# EasyEDA Pro project ME4Driver.eprj

# Schematic Schematic1
Board Name: Board1; Create Date: 2025-03-02; Page Name: P1; Project Name: ME4Driver; Schematic Name: Schematic1; Update Date: 2025-03-06; Company: 嘉立创EDA; Page Size: A4; Version: V1.0
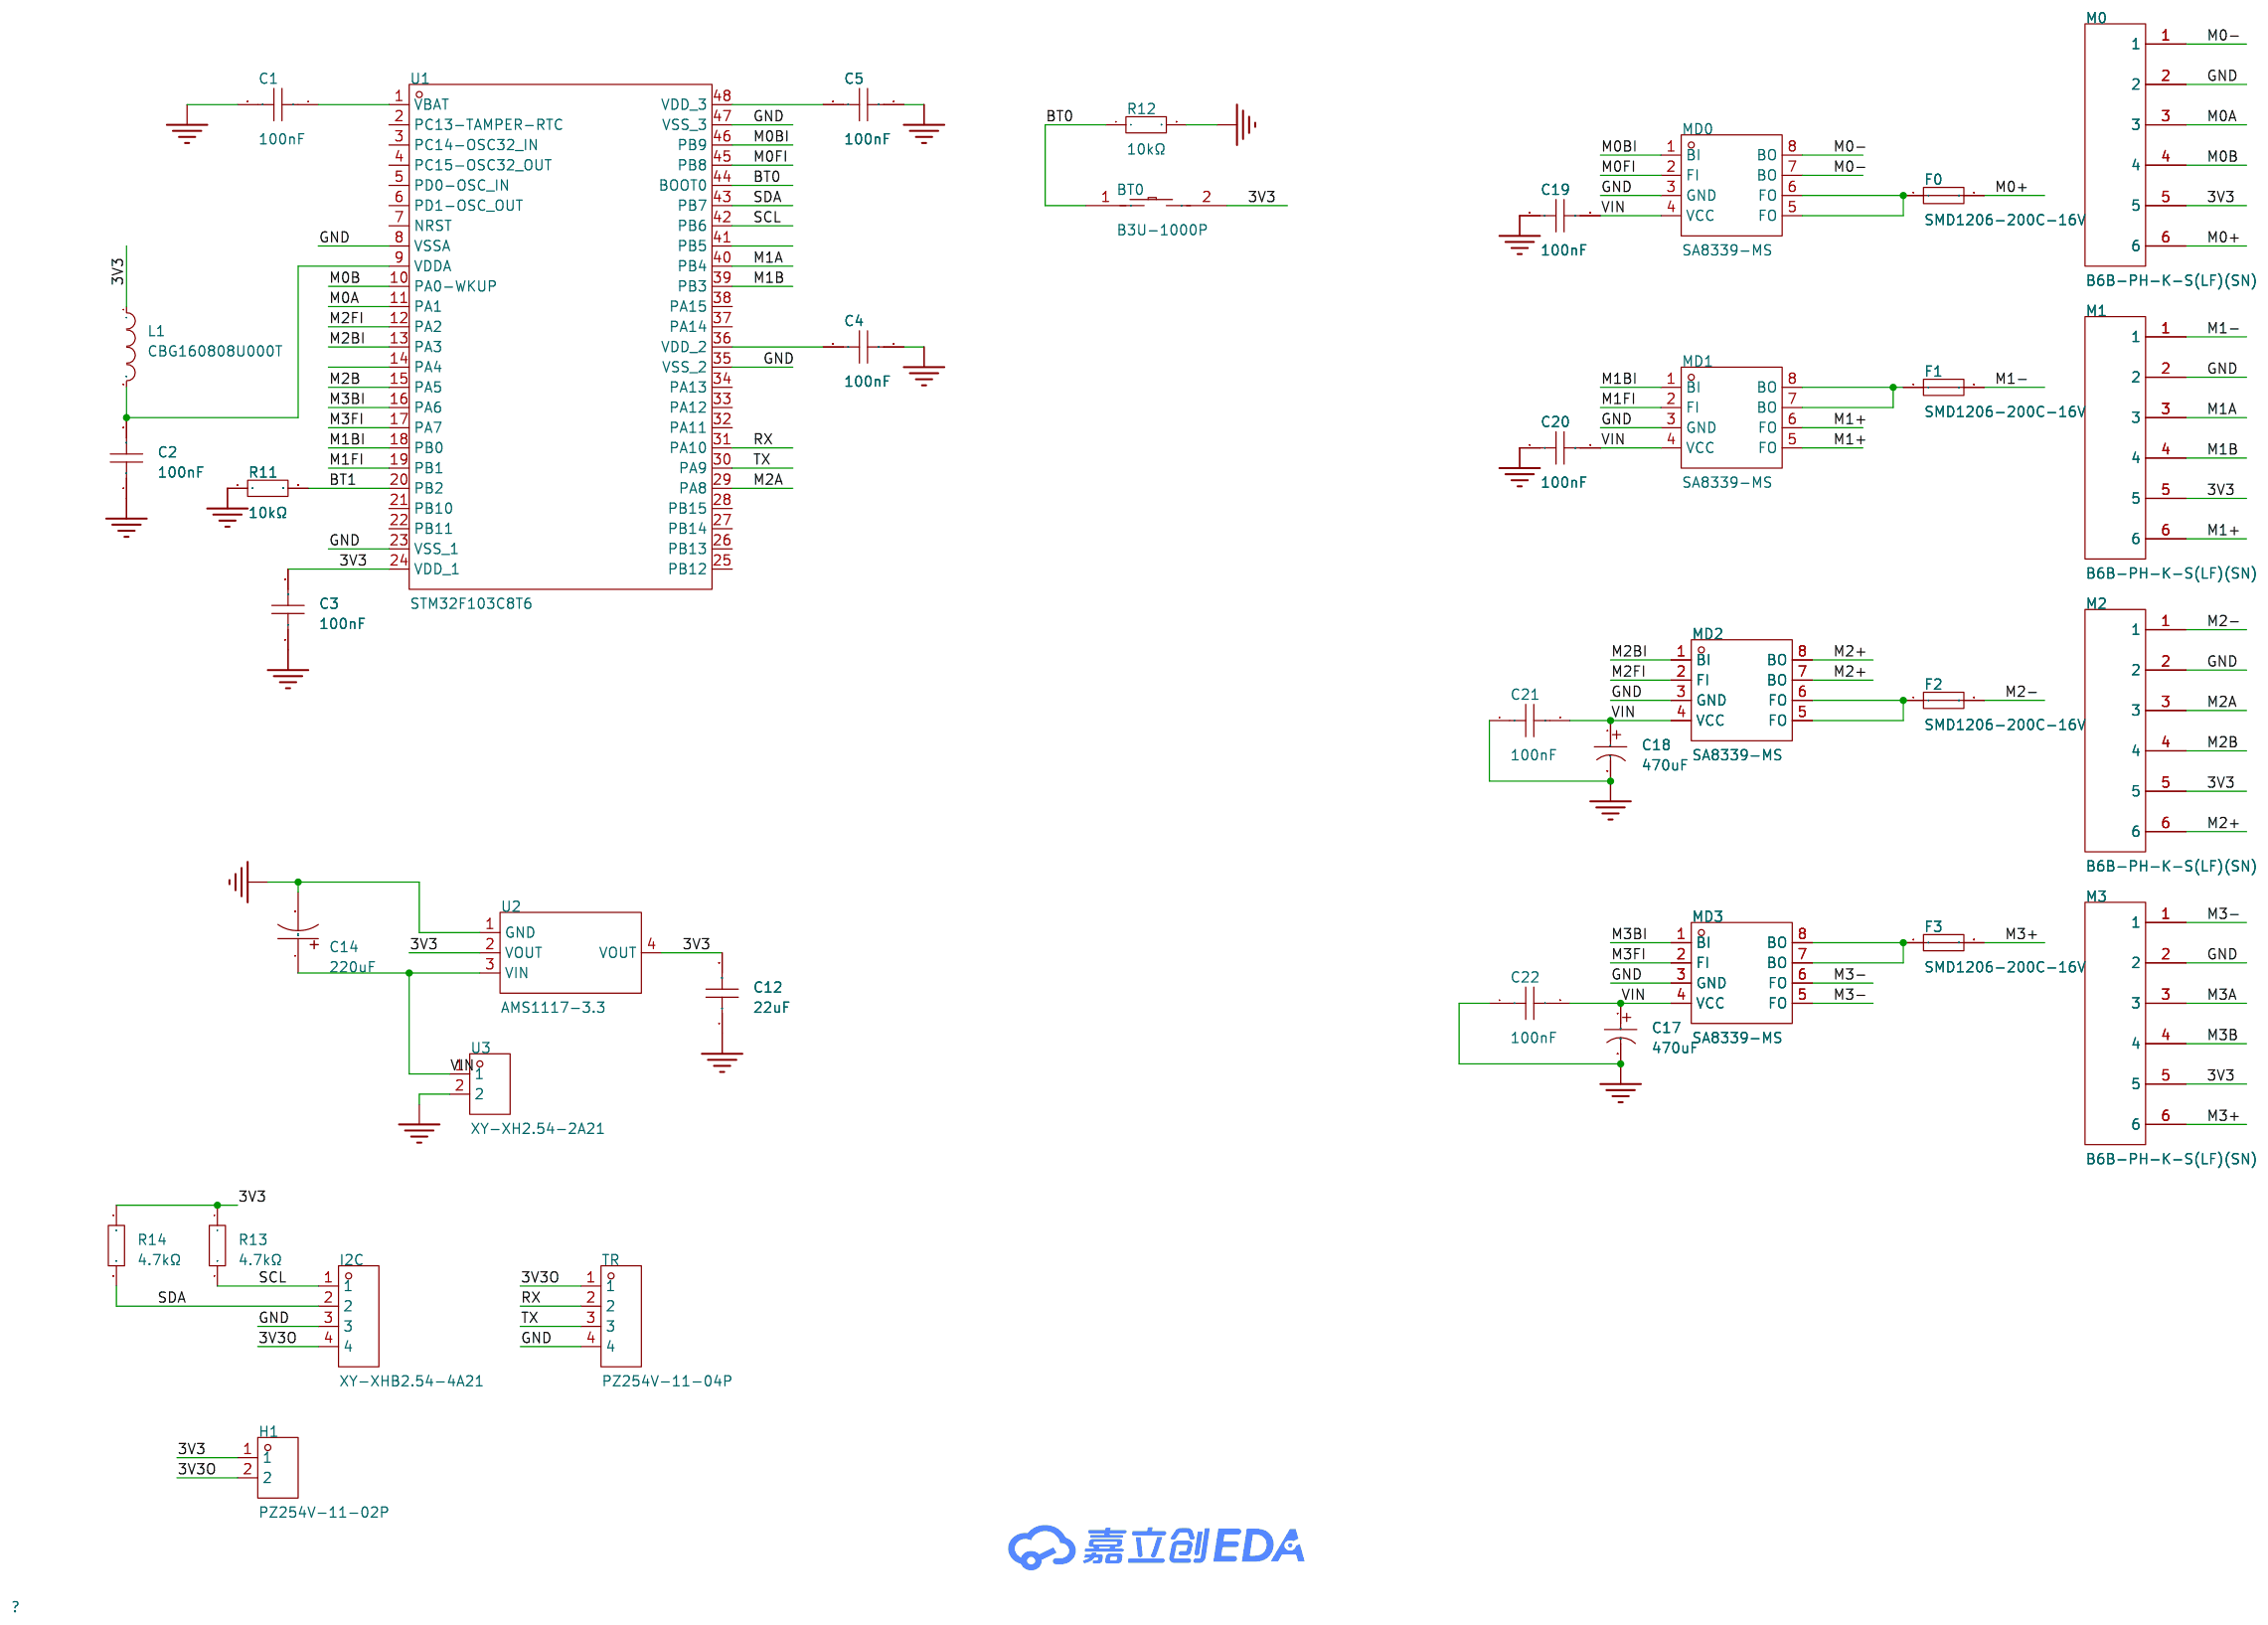
[diagram p0: schematic sheet]

## Parts
BT0  B3U-1000P  [KEY-SMD_B3U-1000PM]
C1  100nF  [C0603]
C2  100nF  [C0603]
C3  100nF  [C0603]
C4  100nF  [C0603]
C5  100nF  [C0603]
C12  22uF  [CASE-A_3216]
C14  220uF  [CAP-SMD_BD6.3-L6.6-W6.6-FD]
C17  470uF  [CAP-TH_BD8.0-P3.50-D0.6-FD]
C18  470uF  [CAP-TH_BD8.0-P3.50-D0.6-FD]
C19  100nF  [C0603]
C20  100nF  [C0603]
C21  100nF  [C0603]
C22  100nF  [C0603]
F0  SMD1206-200C-16V  [F1206]
F1  SMD1206-200C-16V  [F1206]
F2  SMD1206-200C-16V  [F1206]
F3  SMD1206-200C-16V  [F1206]
H1  PZ254V-11-02P  [HDR-TH_2P-P2.54-V-M]
I2C  XY-XHB2.54-4A21  [HDR-TH_4P-P2.50-H-F-W7.3-N]
L1  CBG160808U000T  [L0603]
M0  B6B-PH-K-S(LF)(SN)  [CONN-TH_B6B-PH-K-S]
M1  B6B-PH-K-S(LF)(SN)  [CONN-TH_B6B-PH-K-S]
M2  B6B-PH-K-S(LF)(SN)  [CONN-TH_B6B-PH-K-S]
M3  B6B-PH-K-S(LF)(SN)  [CONN-TH_B6B-PH-K-S]
MD0  SA8339-MS  [SOP-8_L4.9-W3.9-P1.27-LS6.0-BL]
MD1  SA8339-MS  [SOP-8_L4.9-W3.9-P1.27-LS6.0-BL]
MD2  SA8339-MS  [SOP-8_L4.9-W3.9-P1.27-LS6.0-BL]
MD3  SA8339-MS  [SOP-8_L4.9-W3.9-P1.27-LS6.0-BL]
R11  10kΩ  [R0603]
R12  10kΩ  [R0603]
R13  4.7kΩ  [R1206]
R14  4.7kΩ  [R1206]
TR  PZ254V-11-04P  [HDR-TH_4P-P2.54-V-M]
U1  STM32F103C8T6  [LQFP-48_L7.0-W7.0-P0.50-LS9.0-BL]
U2  AMS1117-3.3  [SOT-223-3_L6.5-W3.4-P2.30-LS7.0-BR]
U3  XY-XH2.54-2A21  [HDR-TH_2P-P2.50_XY-XH2.54-2A21]

## Library data of the parts
BT0 = B3U-1000P: LCSC Part Name: 3*2.5*1.6mm 立贴 轻触开关; Supplier Part: C231329; Manufacturer: OMRON(欧姆龙); Supplier Footprint: SMD,2.5x3mm; JLCPCB Part Class: 扩展库; Supplier: LCSC; Circuit: 单刀单掷; Actuator Style: 圆形按钮; Operating Force: 1.53N; Mounting Style: 立贴; Switch Length: 3mm; Switch Width: 2.5mm; Switch Height: 1.6mm; Contact Current: 50mA; Voltage Rating (DC): 12V; Pin Style: SMD接片; Operating Temperature: -25℃~+70℃
C1-C5 C19-C22 = CGA0603X7R104K500JT: 容值:100nF;精度:±10%;额定电压:50V;材质(温度系数):X7R;; LCSC Part Name: 100nF ±10% 50V; Supplier Part: C6119867; Manufacturer: HRE(芯声); Supplier Footprint: 0603; JLCPCB Part Class: 扩展库; Supplier: LCSC; Tolerance: ±10%; Voltage Rated: 50V; Temperature Coefficient: X7R
C12 = TAJA226K010RNJ: LCSC Part Name: 22uF ±10% 10V; Supplier Part: C11366; Manufacturer: Kyocera AVX; Supplier Footprint: CASE-A-3216; JLCPCB Part Class: Extended Part; Datasheet: https://atta.szlcsc.com/upload/public/pdf/source/20160107/1457707750344.pdf; Supplier: LCSC; Tolerance: ±10%; Rated Voltage: 10V; Equivalent Series Resistance(ESR): 3Ω@100kHz; Operating Temperature: -55℃~+125℃
C14 = VT1C221M-CRE77: LCSC Part Name: 220uF ±20% 16V; Supplier Part: C294521; Manufacturer: VT(首科); Supplier Footprint: SMD,D6.3xL7.7mm; JLCPCB Part Class: 扩展库; Datasheet: https://atta.szlcsc.com/upload/public/pdf/source/20181029/C324063_620585B2DB5C8ABB183828EAB4CD59C7.pdf; Supplier: LCSC; Tolerance: ±20%; Rated Voltage: 16V; φD: 6.3mm; L: 7.7mm; Lifetime @ Temp: 1000hrs@105℃; Operating Temperature: -40℃~+105℃
C17 C18 = KF471M025F115A: LCSC Part Name: 470uF ±20% 25V; Supplier Part: C59352; Manufacturer: CapXon(丰宾); Supplier Footprint: 插件,D8xL11.5mm; JLCPCB Part Class: Extended Part; Datasheet: https://atta.szlcsc.com/upload/public/pdf/source/20160702/1467448308274.pdf; Supplier: LCSC; Tolerance: ±20%; Rated Voltage: 25V; Lead Spacing: 3.5mm; φD: 8mm; L: 11.5mm; Lifetime @ Temp: 3000hrs@105℃
F0-F3 = SMD1206-200C-16V: LCSC Part Name: 16V 2A 1206自恢复; Supplier Part: C2843986; Manufacturer: BNstar(比诺星); Supplier Footprint: 1206; JLCPCB Part Class: Extended Part; Datasheet: https://atta.szlcsc.com/upload/public/pdf/source/20210702/C2843986_521BE662BDE0C432A0859FD7515D21C0.pdf; Supplier: LCSC; Voltage - Max: 16V; Current - Max: 40A; Hold Current: 2A; Trip Current: 3.5A; Power Dissipation: 800mW; Resistance - Initial (Ri) (Min): 15mΩ; Resistance - Post Trip (R1) (Max): 80mΩ; Time to Trip(Max): 1.5s; Operating Temperature: -40℃~+85℃
H1 = PZ254V-11-02P: LCSC Part Name: 间距:2.54mm 1x2P 直插 方针; Supplier Part: C492401; Manufacturer: XFCN(兴飞); Supplier Footprint: 插件,P=2.54mm; JLCPCB Part Class: 扩展库; Datasheet: https://atta.szlcsc.com/upload/public/pdf/source/20200309/C492401_A812433581A9B211A7FFA413ADDFF0E5.pdf; Supplier: LCSC; Pin Structure: 1x2P; Pitch: 2.54mm; Circluar Pins/Square Pins: 方针; Mounting Type: 直插; Number of Rows: 单排; Number of Pins: 2P; Length of Mating Pin: 6mm; Insulation Height: 2.5mm; Length of End Connection Pin: 3mm; Contact Material: 黄铜; Operating Temperature Range: -40℃~+105℃; Color: 黑色
I2C = XY-XHB2.54-4A21: LCSC Part Name: 1x4P 间距:2.54mm 弯插; Supplier Part: C19271397; Manufacturer: XYECONN(辛译); Supplier Footprint: 弯插,P=2.54mm; JLCPCB Part Class: 扩展库; Datasheet: https://atta.szlcsc.com/upload/public/pdf/source/20231124/E581531705911B495C6E735B7C4EA3F8.pdf; Supplier: LCSC; Pins Structure: 1x4P; Pitch: 2.54mm; Mounting Style: 弯插; Number of Pins: 4P; Number of Rows: 1; Number of PINs Per Row: 4; Row Spacing: 2.54mm; Current Rating (Max): 2A; Operating Temperature Range: -25℃~+85℃
L1 = CBG160808U000T: 标称阻抗@测试频率:0Ω@100MHz;直流电阻(RDC):100mΩ;; LCSC Part Name: 单路 0603磁珠 阻抗0Ω@100MHz; Supplier Part: C43163; Manufacturer: FH(风华); Supplier Footprint: 0603; JLCPCB Part Class: 扩展库; Datasheet: https://atta.szlcsc.com/upload/public/pdf/source/20190129/C361667_1614D407CC98D1D3CFBD9E1F7511C14D.pdf; Supplier: LCSC; Impedance @ Frequency: 0Ω@100MHz; DC Resistance: 100mΩ; Current Rating: 800mA; Circuits: 1
M0-M3 = B6B-PH-K-S(LF)(SN): LCSC Part Name: 1x6P 间距:2mm 直插 系列:PH; Supplier Part: C131342; Manufacturer: JST; Supplier Footprint: 插件,P=2mm; JLCPCB Part Class: 扩展库; Datasheet: https://atta.szlcsc.com/upload/public/pdf/source/20171026/C131342_15089839687311058815.pdf; Supplier: LCSC; Pins Structure: 1x6P; Pitch: 2mm; Mounting Style: 直插; Reference Series: PH; Number of Pins: 6P; Number of Rows: 1; Number of PINs Per Row: 6; Current Rating (Max): 2A; Contact Material: 黄铜; Contact Plating: 锡; Operating Temperature Range: -25℃~+85℃; Rated Voltage (Max): 100V; Plastic Material: PA66; Flame Retardant Rating: UL94V-0; Supplementary Features: 打K脚; Colour: 白色; Z-Height of the Board: 6mm; X-Length of Bottom Edge on Board (Spacing Line): 13.9mm; Y-Width of Bottom Edge on Board: 4.5mm
MD0-MD3 = SA8339-MS: Supplier Part: C22462547; Manufacturer: MSKSEMI(美森科); Supplier Footprint: SOP-8; JLCPCB Part Class: 扩展库; Datasheet: https://atta.szlcsc.com/upload/public/pdf/source/20240621/3CEF47547D05350EDF4225945F34EFF8.pdf; Supplier: LCSC
R11 R12 = 0603WAF1002T5E: 电阻类型:厚膜电阻;阻值:10kΩ;精度:±1%;功率:100mW;最大工作电压:75V;温度系数:±100ppm/℃;; LCSC Part Name: 厚膜电阻 10kΩ ±1% 100mW; Supplier Part: C25804; Manufacturer: UNI-ROYAL(厚声); Supplier Footprint: 0603; JLCPCB Part Class: Basic Part; Datasheet: https://atta.szlcsc.com/upload/public/pdf/source/20200306/C422600_1E6D84923E4A46A82E41ADD87F860B5C.pdf; Supplier: LCSC; Type: 厚膜电阻; Tolerance: ±1%; Power(Watts): 100mW; Overload Voltage (Max): 75V; Temperature Coefficient: ±100ppm/℃; Operating Temperature Range: -55℃~+155℃
R13 R14 = 1206W4F4701T5E: LCSC Part Name: 4.7kΩ ±1% 250mW 厚膜电阻; Supplier Part: C17936; Manufacturer: UNI-ROYAL(厚声); Supplier Footprint: 1206; JLCPCB Part Class: 基础库; Datasheet: https://atta.szlcsc.com/upload/public/pdf/source/20200306/C422600_1E6D84923E4A46A82E41ADD87F860B5C.pdf; Supplier: LCSC; Type: 厚膜电阻; Tolerance: ±1%; Power(Watts): 250mW; Overload Voltage (Max): 200V; Temperature Coefficient: ±100ppm/℃; Operating Temperature Range: -55℃~+155℃
TR = PZ254V-11-04P: LCSC Part Name: 间距:2.54mm 1x4P 直插 方针; Supplier Part: C2691448; Manufacturer: XFCN(兴飞); Supplier Footprint: 插件,P=2.54mm; JLCPCB Part Class: 扩展库; Datasheet: https://atta.szlcsc.com/upload/public/pdf/source/20200309/C492403_F9F19131791D08044AD4F84F8E751A34.pdf; Supplier: LCSC; Pin Structure: 1x4P; Pitch: 2.54mm; Circluar Pins/Square Pins: 方针; Mounting Type: 直插; Number of Rows: 单排; Number of Pins: 4P; Current Rating (Max): 3A; Voltage Rating (Max): 250V; Length of Mating Pin: 6mm; Insulation Height: 2.5mm; Length of End Connection Pin: 3mm; Operating Temperature Range: -40℃~+105℃; Color: 黑色
U1 = STM32F103C8T6: LCSC Part Name: 主流增强型ARM Cortex-M3 MCU，具有64 KB Flash、72 MHz CPU、电机控制、USB和CAN; Supplier Part: C8734; Manufacturer: ST(意法半导体); Supplier Footprint: LQFP-48(7x7); JLCPCB Part Class: 扩展库; Datasheet: https://atta.szlcsc.com/upload/public/pdf/source/20220812/8363ACEC51AD55ECEB84799464F7CB85.pdf; Supplier: LCSC; CPU Core: ARM-M3; CPU Maximum Speed: 72MHz; Program Storage Size: 64KB; Program Memory Type: FLASH; Number of I/O: 37; ADC (Bit): 12bit; Low Voltage Detection Threshold: 2V~3.6V
U2 = AMS1117-3.3_C6186: LCSC Part Name: 输出3.3V 1A; Supplier Part: C6186; Manufacturer: AMS; Supplier Footprint: SOT-223; JLCPCB Part Class: Basic Part; Datasheet: https://atta.szlcsc.com/upload/public/pdf/source/20180727/C6186_7A095716F0823C02F1997A905E26C086.pdf; Supplier: LCSC; Output Type: 固定; Output Voltage: 3.3V; Output Current: 1A; Power Supply Rejection Ratio (PSRR): 72dB@(120Hz); Voltage Dropout: 1.3V@(800mA); Features: 过流保护(OCP)；热保护(TSD); Output Configuration: 正极; Number of Outputs: 1
U3 = XY-XH2.54-2A21: LCSC Part Name: 1x2P 间距:2.54mm 弯插; Supplier Part: C19271377; Manufacturer: XYECONN(辛译); Supplier Footprint: 弯插,P=2.54mm; JLCPCB Part Class: 扩展库; Datasheet: https://atta.szlcsc.com/upload/public/pdf/source/20231124/D66390E8C06C0EE50596E66A88591188.pdf; Supplier: LCSC; Pins Structure: 1x2P; Pitch: 2.54mm; Mounting Style: 弯插; Number of Pins: 2P; Number of Rows: 1; Number of PINs Per Row: 2; Row Spacing: 2.54mm; Current Rating (Max): 3A; Operating Temperature Range: -25℃~+85℃

## Nets
3V3: BT0.2 C3.2 C12.2 H1.1 L1.1 M0.5 M1.5 M2.5 M3.5 R13.1 R14.1 U1.24(VDD_1) U2.2(VOUT) U2.4(VOUT)
3V3O: H1.2 I2C.4 TR.1
GND: C1.2 C2.1 C3.1 C4.1 C5.1 C12.1 C14.2 C17.2 C18.2 C19.1 C20.1 C21.1 C22.1 I2C.3 M0.2 M1.2 M2.2 M3.2 MD0.3(GND) MD1.3(GND) MD2.3(GND) MD3.3(GND) R11.1 R12.2 TR.4 U1.8(VSSA) U1.23(VSS_1) U1.35(VSS_2) U1.47(VSS_3) U2.1(GND) U3.2
VIN: C14.1 C17.1 C18.1 C19.2 C20.2 C21.2 C22.2 MD0.4(VCC) MD1.4(VCC) MD2.4(VCC) MD3.4(VCC) U2.3(VIN) U3.1
BT0: BT0.1 R12.1 U1.44(BOOT0)
BT1: R11.2 U1.20(PB2)
M0+: F0.2 M0.6
M0-: M0.1 MD0.7(BO) MD0.8(BO)
M0A: M0.3 U1.11(PA1)
M0B: M0.4 U1.10(PA0-WKUP)
M0BI: MD0.1(BI) U1.46(PB9)
M0FI: MD0.2(FI) U1.45(PB8)
M1+: M1.6 MD1.5(FO) MD1.6(FO)
M1-: F1.2 M1.1
M1A: M1.3 U1.40(PB4)
M1B: M1.4 U1.39(PB3)
M1BI: MD1.1(BI) U1.18(PB0)
M1FI: MD1.2(FI) U1.19(PB1)
M2+: M2.6 MD2.7(BO) MD2.8(BO)
M2-: F2.2 M2.1
M2A: M2.3 U1.29(PA8)
M2B: M2.4 U1.15(PA5)
M2BI: MD2.1(BI) U1.13(PA3)
M2FI: MD2.2(FI) U1.12(PA2)
M3+: F3.2 M3.6
M3-: M3.1 MD3.5(FO) MD3.6(FO)
M3A: M3.3
M3B: M3.4
M3BI: MD3.1(BI) U1.16(PA6)
M3FI: MD3.2(FI) U1.17(PA7)
RX: TR.2 U1.31(PA10)
SCL: I2C.1 R13.2 U1.42(PB6)
SDA: I2C.2 R14.2 U1.43(PB7)
TX: TR.3 U1.30(PA9)
$1N1753: C5.2 U1.48(VDD_3)
$1N1757: C4.2 U1.36(VDD_2)
$1N2374: F0.1 MD0.5(FO) MD0.6(FO)
$1N2423: F2.1 MD2.5(FO) MD2.6(FO)
$1N2448: F3.1 MD3.7(BO) MD3.8(BO)
$1N5496: C2.2 L1.2 U1.9(VDDA)
$1N5615: C1.1 U1.1(VBAT)
$1N7076: F1.1 MD1.7(BO) MD1.8(BO)

Not connected (* = marked no-connect by the designer): U1 2(PC13-TAMPER-RTC) 3(PC14-OSC32_IN) 4(PC15-OSC32_OUT) 5(PD0-OSC_IN) 6(PD1-OSC_OUT) 7(NRST) 14(PA4) 21(PB10) 22(PB11) 25(PB12) 26(PB13) 27(PB14) 28(PB15) 32(PA11) 33(PA12) 34(PA13) 37(PA14) 38(PA15) 41(PB5)

# Board PCB1
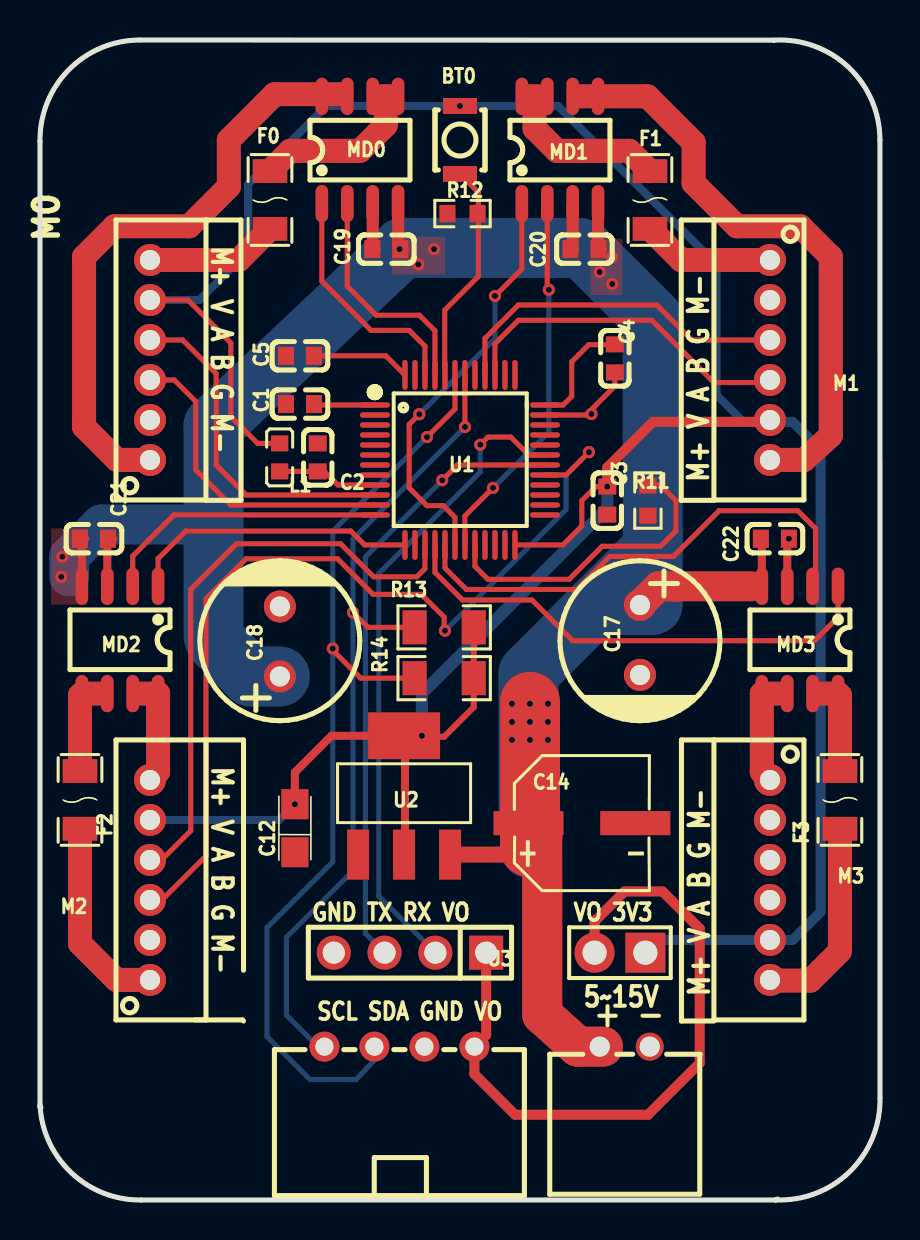
[diagram p1: board, top side]
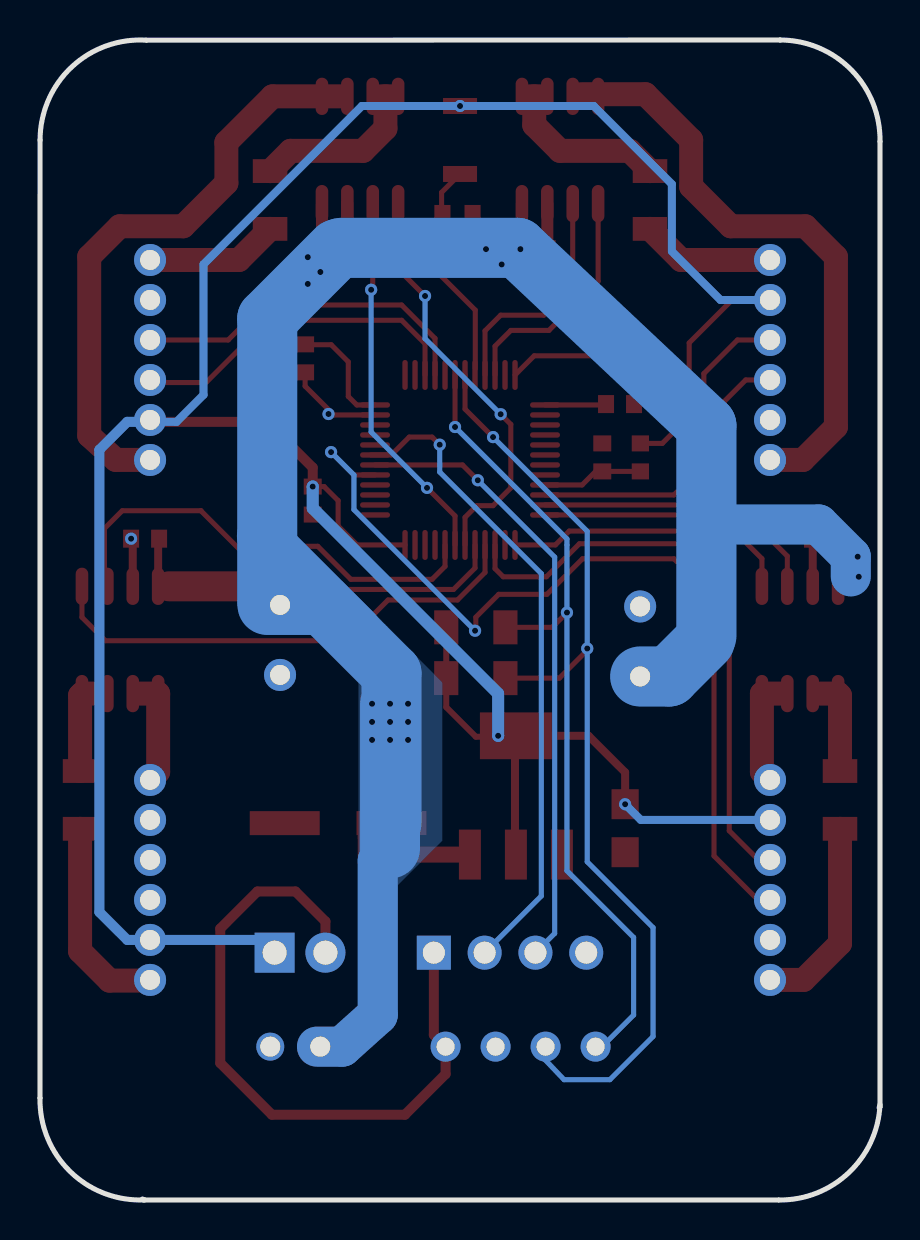
[diagram p2: board, bottom side, seen from below]

Outline 42 x 58.01 mm; copper layers: Top Layer, Bottom Layer. Coordinates in mm from the lower left corner of the outline.
Outline path: 0.04,4.62 0,4.67 0,52.93 arc(1.44,56.51) 5,58.01 36.7,58 arc(40.43,56.64) 42,53 42,5.1 arc(40.5,1.43) 36.79,0.01 36.88,0.05 ; 0,4.78 arc(1.56,1.37) 5.06,0 36.83,0
Stack: Top Layer 0.035mm / Dielectric1 1.51mm FR4 er 4.5 / Bottom Layer 0.035mm

## Design rules (mm)
template: JLCPCB Capability(Two Layers Board)
spacing copperThickness1oz (default): track to track 0.102, other pairs 0.152 to 0.3
spacing copperThickness2oz: track to track 0.203, other pairs 0.152 to 0.3
track width copperThickness1oz (default): min 0.127, default 0.254, max 2.54
track width copperThickness2oz: min 0.203, default 0.254, max 2.54
differential pair differentialPair (default): width min 0.127, default 0.254, max 2.54; gap min 0.152, default 0.152
via viaSize (default): diameter min 0.5, default 0.61, max 10; hole min 0.3, default 0.305, max 6.3

## Placement (name value [footprint] x y rotation side)
BT0  B3U-1000P  [KEY-SMD_B3U-1000PM]  21 53.01 90 top
C1  100nF  [C0603]  13 39.8 180 top
C2  100nF  [C0603]  13.89 37.13 270 top
C3  100nF  [C0603]  28.37 34.97 90 top
C4  100nF  [C0603]  28.75 42.09 90 top
C5  100nF  [C0603]  13 42.21 0 top
C12  22uF  [CASE-A_3216]  12.75 18.59 90 top
C14  220uF  [CAP-SMD_BD6.3-L6.6-W6.6-FD]  27.1 18.85 0 top
C17  470uF  [CAP-TH_BD8.0-P3.50-D0.6-FD]  30 28.01 270 top
C18  470uF  [CAP-TH_BD8.0-P3.50-D0.6-FD]  11.99 27.93 90 top
C19  100nF  [C0603]  17.32 47.55 0 top
C20  100nF  [C0603]  27.22 47.55 0 top
C21  100nF  [C0603]  2.7 33.07 180 top
C22  100nF  [C0603]  36.75 33.07 180 top
F0  SMD1206-200C-16V  [F1206]  11.5 50.01 270 top
F1  SMD1206-200C-16V  [F1206]  30.5 50.01 270 top
F2  SMD1206-200C-16V  [F1206]  2 20.01 270 top
F3  SMD1206-200C-16V  [F1206]  40 20.01 270 top
H1  PZ254V-11-02P  [HDR-TH_2P-P2.54-V-M]  29 12.37 180 top
I2C  XY-XHB2.54-4A21  [HDR-TH_4P-P2.50-H-F-W7.3-N]  17.97 7.67 0 top
L1  CBG160808U000T  [L0603]  11.98 37.13 270 top
M0  B6B-PH-K-S(LF)(SN)  [CONN-TH_B6B-PH-K-S]  5.5 42.01 270 top
M1  B6B-PH-K-S(LF)(SN)  [CONN-TH_B6B-PH-K-S]  36.5 42.01 90 top
M2  B6B-PH-K-S(LF)(SN)  [CONN-TH_B6B-PH-K-S]  5.5 16.01 270 top
M3  B6B-PH-K-S(LF)(SN)  [CONN-TH_B6B-PH-K-S]  36.5 16.01 90 top
MD0  SA8339-MS  [SOP-8_L4.9-W3.9-P1.27-LS6.0-BL]  16 52.51 0 top
MD1  SA8339-MS  [SOP-8_L4.9-W3.9-P1.27-LS6.0-BL]  26 52.51 0 top
MD2  SA8339-MS  [SOP-8_L4.9-W3.9-P1.27-LS6.0-BL]  4 28.01 180 top
MD3  SA8339-MS  [SOP-8_L4.9-W3.9-P1.27-LS6.0-BL]  38 28.01 180 top
R11  10kΩ  [R0603]  30.4 34.97 90 top
R12  10kΩ  [R0603]  21.13 49.33 180 top
R13  4.7kΩ  [R1206]  20.21 28.64 180 top
R14  4.7kΩ  [R1206]  20.21 26.1 180 top
TR  PZ254V-11-04P  [HDR-TH_4P-P2.54-V-M]  18.5 12.37 180 top
U1  STM32F103C8T6  [LQFP-48_L7.0-W7.0-P0.50-LS9.0-BL]  21 37.01 270 top
U2  AMS1117-3.3  [SOT-223-3_L6.5-W3.4-P2.30-LS7.0-BR]  18.21 20.24 270 top
U3  XY-XH2.54-2A21  [HDR-TH_2P-P2.50_XY-XH2.54-2A21]  29.24 7.67 0 top

## Footprints (pads in the part's own frame, mm; a bottom-side part is the same pattern mirrored in y, then rotated)
C0603
  rect 0.8x0.9 smd: 1(-0.7,0) 2(0.7,0)
CAP-SMD_BD6.3-L6.6-W6.6-FD
  rect 3.5x1.2 smd: 1(-2.67,0) 2(2.67,0)
CAP-TH_BD8.0-P3.50-D0.6-FD
  round 1.6 hole 1: 1(-1.75,0) 2(1.75,0)
CASE-A_3216
  rect 1.5x1.359 smd: 1(-1.2,0) 2(1.2,0)
CONN-TH_B6B-PH-K-S
  round 1.6 hole 1: 1(5,0) 2(3,0) 3(1,0) 4(-1,0) 5(-3,0) 6(-5,0)
F1206
  rect 1.19x1.728 smd: 1(-1.445,0) 2(1.445,0)
HDR-TH_2P-P2.50_XY-XH2.54-2A21
  rect 1.4x1.4 hole 1: 1(-1.25,0)
  round 1.4 hole 1: 2(1.25,0)
HDR-TH_2P-P2.54-V-M
  rect 2x2 hole 1.2: 1(-1.27,0)
  round 2 hole 1.2: 2(1.27,0)
HDR-TH_4P-P2.50-H-F-W7.3-N
  round 1.5 hole 0.9: 1(-3.75,0) 2(-1.25,0) 3(1.25,0) 4(3.75,0)
HDR-TH_4P-P2.54-V-M
  rect 1.7x1.7 hole 1.1: 1(-3.81,0)
  round 1.7 hole 1.1: 2(-1.27,0) 3(1.27,0) 4(3.81,0)
KEY-SMD_B3U-1000PM
  rect 0.8x1.7 smd: 1(-1.7,0) 2(1.7,0)
L0603
  rect 0.8x0.864 smd: 1(-0.7,0) 2(0.7,0)
LQFP-48_L7.0-W7.0-P0.50-LS9.0-BL
  oval 0.27x1.5 smd: 1(-2.75,-4.25) 2(-2.25,-4.25) 3(-1.75,-4.25) 4(-1.25,-4.25) 5(-0.75,-4.25) 6(-0.25,-4.25) 7(0.25,-4.25) 8(0.75,-4.25) 9(1.25,-4.25) 10(1.75,-4.25) 11(2.25,-4.25) 12(2.75,-4.25) 25(2.75,4.25) 26(2.25,4.25) 27(1.75,4.25) 28(1.25,4.25) 29(0.75,4.25) 30(0.25,4.25) 31(-0.25,4.25) 32(-0.75,4.25) 33(-1.25,4.25) 34(-1.75,4.25) 35(-2.25,4.25) 36(-2.75,4.25)
  oval 1.5x0.27 smd: 13(4.25,-2.75) 14(4.25,-2.25) 15(4.25,-1.75) 16(4.25,-1.25) 17(4.25,-0.75) 18(4.25,-0.25) 19(4.25,0.25) 20(4.25,0.75) 21(4.25,1.25) 22(4.25,1.75) 23(4.25,2.25) 24(4.25,2.75) 37(-4.25,2.75) 38(-4.25,2.25) 39(-4.25,1.75) 40(-4.25,1.25) 41(-4.25,0.75) 42(-4.25,0.25) 43(-4.25,-0.25) 44(-4.25,-0.75) 45(-4.25,-1.25) 46(-4.25,-1.75) 47(-4.25,-2.25) 48(-4.25,-2.75)
R0603
  rect 0.806x0.864 smd: 1(-0.753,0) 2(0.753,0)
R1206
  rect 1.208x1.701 smd: 1(-1.479,0) 2(1.479,0)
SOP-8_L4.9-W3.9-P1.27-LS6.0-BL
  oval 0.63x1.865 smd: 1(-1.905,-2.683) 2(-0.635,-2.683) 3(0.635,-2.683) 4(1.905,-2.683) 5(1.905,2.683) 6(0.635,2.683) 7(-0.635,2.683) 8(-1.905,2.683)
SOT-223-3_L6.5-W3.4-P2.30-LS7.0-BR
  rect 2.5x1.1 smd: 1(2.97,-2.3) 2(2.97,0) 3(2.97,2.3)
  rect 2.34x3.6 smd: 4(-2.97,0)

## Nets
As in the schematic.

Pads without a net: U1 2 3 4 5 6 7 21 22 25 26 27 28 32 33 34 37 38

## Via types
v1: diameter 0.61, hole 0.305, Top Layer to Bottom Layer, 35 vias

## Routing (per net, layer and track width the routed paths; a pad name or vN(x,y) marks a point on that pad's centre or on a via; arc(x,y) is an arc through that point)
3V3: length 157.3
  Top Layer w0.254: M0.5 7.4,45.01 9.54,42.86 9.54,39.18 10.89,37.83 L1.1 ; U1.24 26.15,32.76 27.1,33.7 27.1,34.97 27.8,35.67 v1(28.37,35.67)
  Top Layer w0.3: U2.4 18.25,23.17 20.21,23.17 21.69,24.64 R13.1
  Top Layer w0.4: v1(12.75,19.79) 12.75,21.39 14.57,23.21 U2.4 ; 18.25,23.17 18.25,17.32 U2.2
  Top Layer w0.5: v1(28.37,35.67) 28.37,36.63 30.65,38.91 36.41,38.91 M1.5
  Bottom Layer w0.4: M0.5 7.97,45.01 10.41,47.44 10.41,50.8 14.32,54.71 v1(21,54.71) 25.91,54.71 33.83,46.79 33.83,40.26 35.18,38.91 36.41,38.91 M1.5 ; M2.5 11.96,19.01 v1(12.75,19.79)
  Bottom Layer w0.5: H1.1 30.91,13.01 M3.5 37.64,13.01 39.03,14.4 39.03,37.51 37.64,38.91 36.41,38.91
  Bottom Layer w0.6: v1(19.09,23.21) 19.1,25.32 28.37,34.59 v1(28.37,35.67)
GND: length 14.3
  Top Layer w0.254: U1.35 27.31,39.26 28.75,40.7 28.75,41.39 C4.1
  Top Layer w0.4: 3.67,33.07 3.37,32.77 MD2.3 ; v1(37.45,33.07) 37.37,32.99 MD3.3
  Top Layer w0.6: MD0.3 16.64,47.66 16.74,47.55 ; MD1.3 26.64,47.56 26.65,47.55
  vias: v1(27.58,39.3)
VIN: length 145
  Top Layer w0.4: 2.27,33.07 2.1,33.14 2.1,30.96 ; C22.2 36.1,33.02 MD3.4
  Top Layer w0.6: MD0.4 17.91,47.79 18.14,47.55 ; MD1.4 27.91,47.69 28.05,47.55
  Top Layer w0.8: U2.3 24.77,17.27
  Top Layer w1.5: C17.1 30.93,30.69 31.83,30.69 ; 31.83,30.69 31.8,30.66 ; 31.83,30.69 35.56,30.69
  Top Layer w2: 24.43,18.85 25.12,18.16 25.12,9.27 26.9,7.67 28.15,7.67
  Top Layer w3: 24.5,17.64 24.5,24.91
  Bottom Layer w2: 1.46,31.18 1.46,32.17 3.07,33.78 7.75,33.78 ; 24.5,17.58 25.12,16.97 25.12,9.27 26.9,7.67 28.15,7.67
  Bottom Layer w2.5: 26.19,28.48 30.91,33.2
  Bottom Layer w3: 8.68,28.2 8.68,38.72 18.12,47.61 26.97,47.61 ; 8.76,27.97 10.55,26.18 C18.1 ; 24.43,18.85 24.43,26.34 27.85,29.76 30.63,29.76 ; 24.5,17.58 24.5,24.77 ; 27.16,47.55 30.64,44.07 30.64,29.96
  vias: v1(1.06,31.16) v1(1.12,32.17) v1(17.98,47.55) v1(18.92,46.78) v1(19.7,47.55) v1(23.6,24.81) v1(23.6,23.91) v1(23.6,23.01) v1(24.5,24.81) v1(24.5,23.91) v1(24.5,23.01) v1(25.4,24.81) v1(25.4,23.91) v1(25.4,23.01) v1(27.98,46.4) v1(28.61,47.15) v1(28.61,45.81)
M1BI: length 20.8
  Top Layer w0.254: v1(18.97,39.29) 18.46,38.78 18.46,35.61 19.35,34.72 20.17,34.72 20.75,34.14 U1.18 ; MD1.1 24.1,46.55 v1(22.75,45.2)
  Bottom Layer w0.254: v1(18.97,39.29) 22.75,43.07 v1(22.75,45.2)
M1FI: length 18.8
  Top Layer w0.254: v1(22.65,35.61) 21.25,34.21 U1.19 ; MD1.2 25.37,45.6 v1(25.44,45.52)
  Bottom Layer w0.254: v1(22.65,35.61) 25.45,38.4 v1(25.44,45.52)
M2A: length 45.7
  Top Layer w0.254: M2.3 6.1,15.01 8.3,17.21 8.3,30.06 10.3,32.06 14.88,32.06 16.65,30.29 19.07,30.29 20.21,29.14 20.21,28.5 ; U1.29 26.31,36.26 v1(27.45,37.4)
  Bottom Layer w0.254: v1(20.25,28.47) 26.31,34.52 26.31,36.26 v1(27.45,37.4)
RX: length 32.6
  Top Layer w0.254: v1(22.02,37.77) 22.4,38.15 23.54,38.15 24.43,37.26 25.46,37.26
  Bottom Layer w0.254: TR.2 16.94,15.2 16.94,31.32 22.02,36.4 v1(22.02,37.77)
SCL: length 41.6
  Top Layer w0.254: 15.65,29.36 16.4,28.64 R13.2 ; U1.42 v1(21.25,38.65)
  Bottom Layer w0.254: I2C.1 13.9,7.67 12.32,9.25 12.32,13.13 15.65,16.46 15.65,33.06 v1(21.25,38.65)
  vias: v1(15.65,29.37)
SDA: length 49
  Top Layer w0.254: 14.64,27.49 16.03,26.1 R14.2 ; U1.43 20.75,39.55 v1(19.35,38.15)
  Bottom Layer w0.254: 16.73,7.67 16.73,7 15.8,6.02 13.51,6.02 11.35,8.18 11.35,13.62 14.64,16.91 14.64,33.44 v1(19.35,38.15)
  vias: v1(14.64,27.58)
TX: length 31.1
  Top Layer w0.254: v1(20.11,35.99) 20.88,36.76 U1.30
  Bottom Layer w0.254: v1(20.11,35.99) 16.27,32.15 16.27,13.33 TR.3
3V3O: length 34.4
  Top Layer w0.5: TR.1 22.31,8.26 I2C.4 21.72,6.3 23.75,4.27 30.41,4.27 32.99,6.85 32.99,13.57 31.13,15.43 29.23,15.43 27.73,13.93 H1.2
BT0: length 10.8
  Top Layer w0.254: 20.24,41.58 20.24,44.5 21.92,46.18 21.92,50.38 BT0.1
BT1: length 15.6
  Top Layer w0.254: U1.20 21.75,31.68 22.4,31.04 26.46,31.04 28.11,32.69 31.03,32.69 31.8,33.45 31.8,34.97 31,35.77 30.4,35.77
M0+: length 6.6
  Top Layer w1.2: M0.6 9.95,47.01 F0.2
M0-: length 30
  Top Layer w1.2: M0.1 5.5,37.01 3.86,37.01 2.2,38.66 2.2,47.17 3.73,48.69 7.46,48.69 9.44,50.67 9.44,53.01 11.73,55.29 14.95,55.29
M0A: length 15.8
  Top Layer w0.254: M0.3 6.71,41.01 7.79,39.93 7.79,36.5 9.54,34.76 U1.11
M0B: length 17.1
  Top Layer w0.254: M0.4 7.13,43.01 8.81,41.32 8.81,36.75 10.31,35.26 U1.10
M0BI: length 11.8
  Top Layer w0.254: MD0.1 14.1,45.94 16.56,43.48 18.46,43.48 19.25,42.69 U1.46
M0FI: length 11.6
  Top Layer w0.254: MD0.2 15.37,45.69 16.81,44.25 18.97,44.25 19.75,43.46 U1.45
M1+: length 29.5
  Top Layer w1.2: 26.99,55.19 30.38,55.19 32.68,52.88 32.68,50.85 34.84,48.69 38.02,48.69 39.54,47.17 39.54,38.22 38.21,37.01 M1.6
M1-: length 6.6
  Top Layer w1.2: F1.2 32.06,47.01 M1.1
M1A: length 17.5
  Top Layer w0.254: U1.40 22.25,43.08 23.92,44.75 30.84,44.75 32.59,43.01 M1.3
M1B: length 17.1
  Top Layer w0.254: U1.39 22.75,42.82 23.92,43.99 30.59,43.99 33.7,40.88 36.37,40.88 M1.4
M2+: length 5.4
  Top Layer w1.2: 4.97,25.32 MD2.8 5.91,21.41 M2.6
M2-: length 10
  Top Layer w1.2: F2.2 2,12.83 3.82,11.01 M2.1
M2B: length 29.4
  Top Layer w0.254: M2.4 6.08,17.01 7.54,18.46 7.54,30.53 9.82,32.82 15.03,32.82 16.68,31.16 18.84,31.16 19.25,31.57 U1.15
M2BI: length 14.6
  Top Layer w0.254: MD2.1 5.91,32.07 7.28,33.45 15.54,33.45 16.23,32.76 U1.13
M2FI: length 14.5
  Top Layer w0.254: MD2.2 4.64,32.2 6.69,34.26 U1.12
M3+: length 10.2
  Top Layer w1.2: M3.6 36.53,10.97 38.53,10.97 40,12.45 F3.2
M3-: length 5.4
  Top Layer w1.2: M3.1 36.1,21.41 MD3.5 37.03,25.32
M3BI: length 25
  Top Layer w0.254: U1.16 19.75,31.38 21.13,30 24.6,30 26.64,27.97 38.73,27.97 39.91,29.14 MD3.1
M3FI: length 25.1
  Top Layer w0.254: U1.17 20.25,31.6 21.32,30.53 26.84,30.53 28.49,32.18 31.67,32.18 33.95,34.46 33.95,34.47 37.89,34.47 38.78,33.58 38.78,30.78 38.65,30.66
$1N1753: length 4.9
  Top Layer w0.254: C5.2 17.29,42.21 U1.48
$1N1757: length 5.8
  Top Layer w0.254: U1.36 26.16,39.76 26.59,40.18 26.59,41.91 27.44,42.77 28.73,42.77 C4.2
$1N2374: length 8.8
  Top Layer w1.2: F0.1 12.51,52.46 16,52.46 17.29,53.75 17.29,55.19 ; 17.58,55.19 17,55.19
$1N2423: length 4.7
  Top Layer w1.2: 2,21.59 2,25.23 MD2.5 2.98,25.32
$1N2448: length 4.8
  Top Layer w1.2: 38.98,25.32 MD3.8 40,25.23 F3.1
$1N5496: length 5
  Top Layer w0.254: L1.2 C2.2 14.22,36.43 14.9,35.76 U1.9
$1N5615: length 3.1
  Top Layer w0.254: C1.1 13.74,39.76 U1.1
$1N7076: length 8.8
  Top Layer w1.2: 24.44,55.19 25.01,55.19 ; 24.73,55.19 24.73,53.58 25.85,52.46 29.47,52.46 30.48,51.45 F1.1

## Copper pours and planes (outline as drawn; the poured copper is in the pictures)
VIN on Top Layer: 27.52,48.07 29.13,48.07 29.13,45.26 27.52,45.26
VIN on Top Layer: 17.6,48.17 20.24,48.17 20.24,46.28 17.6,46.28
VIN on Top Layer: 0.55,33.58 2.33,33.58 2.33,29.77 0.55,29.77
VIN on Bottom Layer: 23.42,27.97 24.6,27.97 24.6,26.98 23.42,26.98
VIN on Bottom Layer: 21.89,33.2 29.13,33.2 29.13,15.67 21.89,15.67

## Text on the board
Top Silkscreen Layer: GND TX RX VO | SCL SDA GND VO | VO 3V3 | M+ V A B G M- | 5~15V | + -
